# EAGLE design PCB_Univ_V0 (EAGLE 9.6.1)
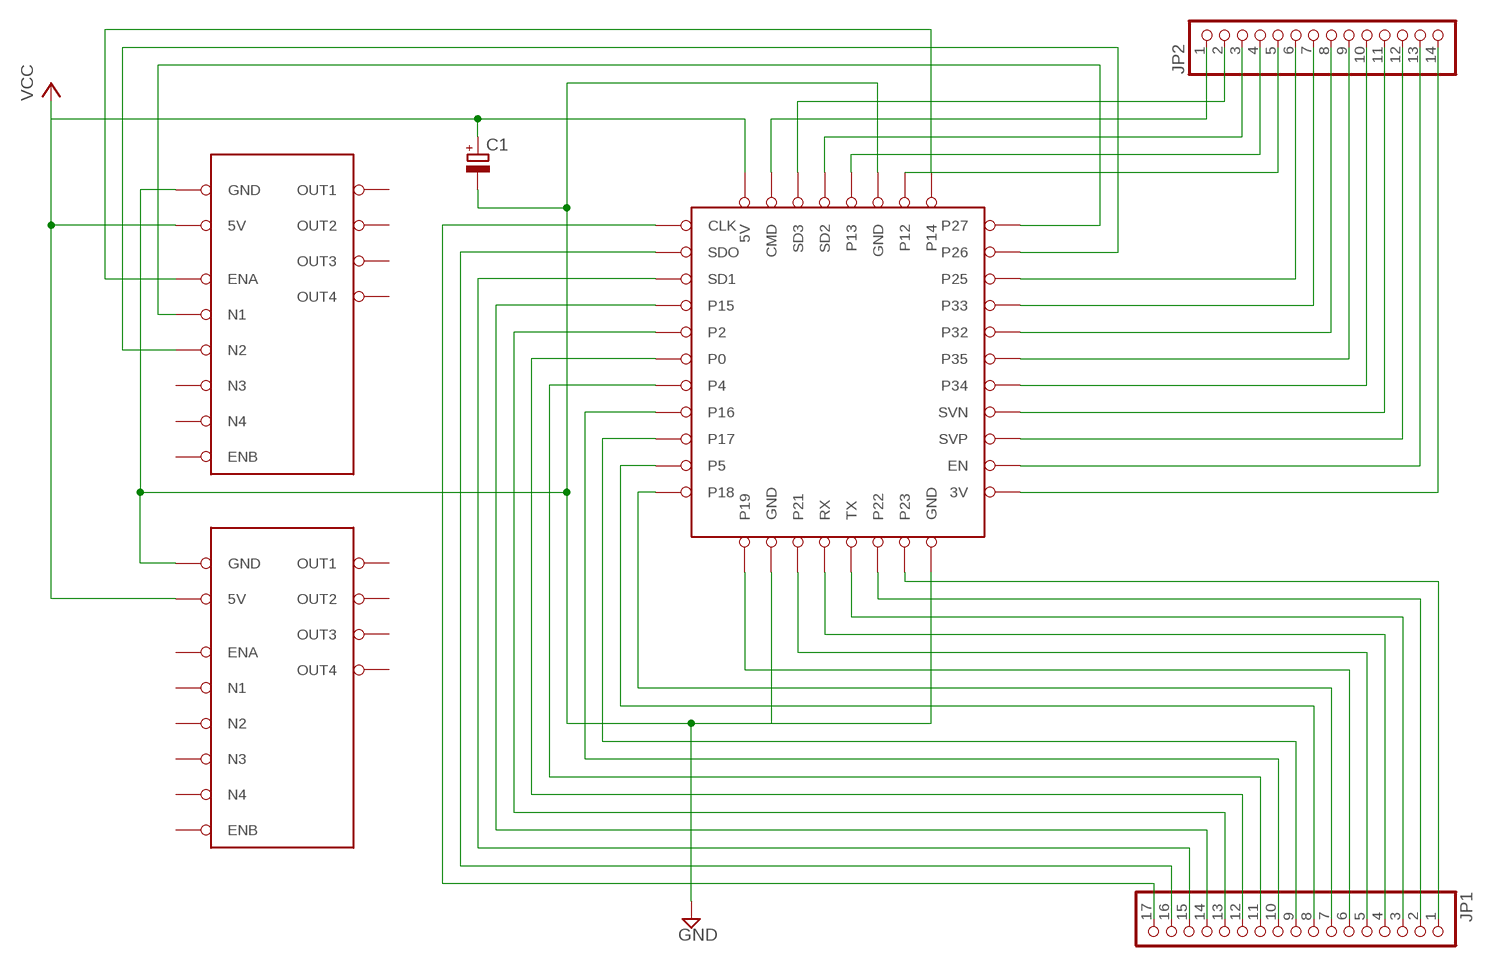
[diagram p0: schematic, sheet 1]

## Parts
C1  CPOL-EUE3.5-8  [E3,5-8]
ESP1  ESP12_MOD  [ESP32_MOD]
JP1  PINHD-1X17  [1X17]
JP2  PINHD-1X14  [1X14]
U$1  DRIVER_MOTOR  [DRIVER_MOTOR]
U$2  DRIVER_MOTOR  [DRIVER_MOTOR]

## Nets
GND: C1.- ESP1.P$13(GND) ESP1.P$19(GND) ESP1.P$33(GND) U$1.GND U$2.GND
N$1: ESP1.P$30(P27) U$1.N1
N$2: ESP1.P$29(P26) U$1.N2
N$3: ESP1.P$31(P14) U$1.ENA
N$4: ESP1.P$37(CMD) JP2.1
N$5: ESP1.P$36(SD3) JP2.2
N$6: ESP1.P$35(SD2) JP2.3
N$7: ESP1.P$34(P13) JP2.4
N$8: ESP1.P$32(P12) JP2.5
N$9: ESP1.P$28(P25) JP2.6
N$10: ESP1.P$27(P33) JP2.7
N$11: ESP1.P$26(P32) JP2.8
N$12: ESP1.P$25(P35) JP2.9
N$13: ESP1.P$24(P34) JP2.10
N$14: ESP1.P$23(SVN) JP2.11
N$15: ESP1.P$22(SVP) JP2.12
N$16: ESP1.P$21(EN) JP2.13
N$17: ESP1.P$20(3V) JP2.14
N$18: ESP1.P$18(P23) JP1.1
N$19: ESP1.P$17(P22) JP1.2
N$20: ESP1.P$16(TX) JP1.3
N$21: ESP1.P$15(RX) JP1.4
N$22: ESP1.P$14(P21) JP1.5
N$23: ESP1.P$12(P19) JP1.6
N$24: ESP1.P$11(P18) JP1.7
N$25: ESP1.P$10(P5) JP1.8
N$26: ESP1.P$9(P17) JP1.9
N$27: ESP1.P$8(P16) JP1.10
N$28: ESP1.P$7(P4) JP1.11
N$29: ESP1.P$6(P0) JP1.12
N$30: ESP1.P$5(P2) JP1.13
N$31: ESP1.P$4(P15) JP1.14
N$32: ESP1.P$3(SD1) JP1.15
N$33: ESP1.P$2(SDO) JP1.16
N$34: ESP1.P$1(CLK) JP1.17
VCC: C1.+ ESP1.P$38(5V) U$1.5V U$2.5V
Unconnected: U$1.ENB U$1.N3 U$1.N4 U$1.OUT1 U$1.OUT2 U$1.OUT3 U$1.OUT4 U$2.ENA U$2.ENB U$2.N1 U$2.N2 U$2.N3 U$2.N4 U$2.OUT1 U$2.OUT2 U$2.OUT3 U$2.OUT4

## Library data of the parts
C1 = rcl2:CPOL-EU: POLARIZED CAPACITOR, European symbol; SPICEPREFIX: C
ESP1 = DAIMOB:ESP12_MOD
JP1 = pinhead:PINHD-1X17: PIN HEADER
JP2 = pinhead:PINHD-1X14: PIN HEADER
U$1 U$2 = DAIMOB:DRIVER_MOTOR

## Board
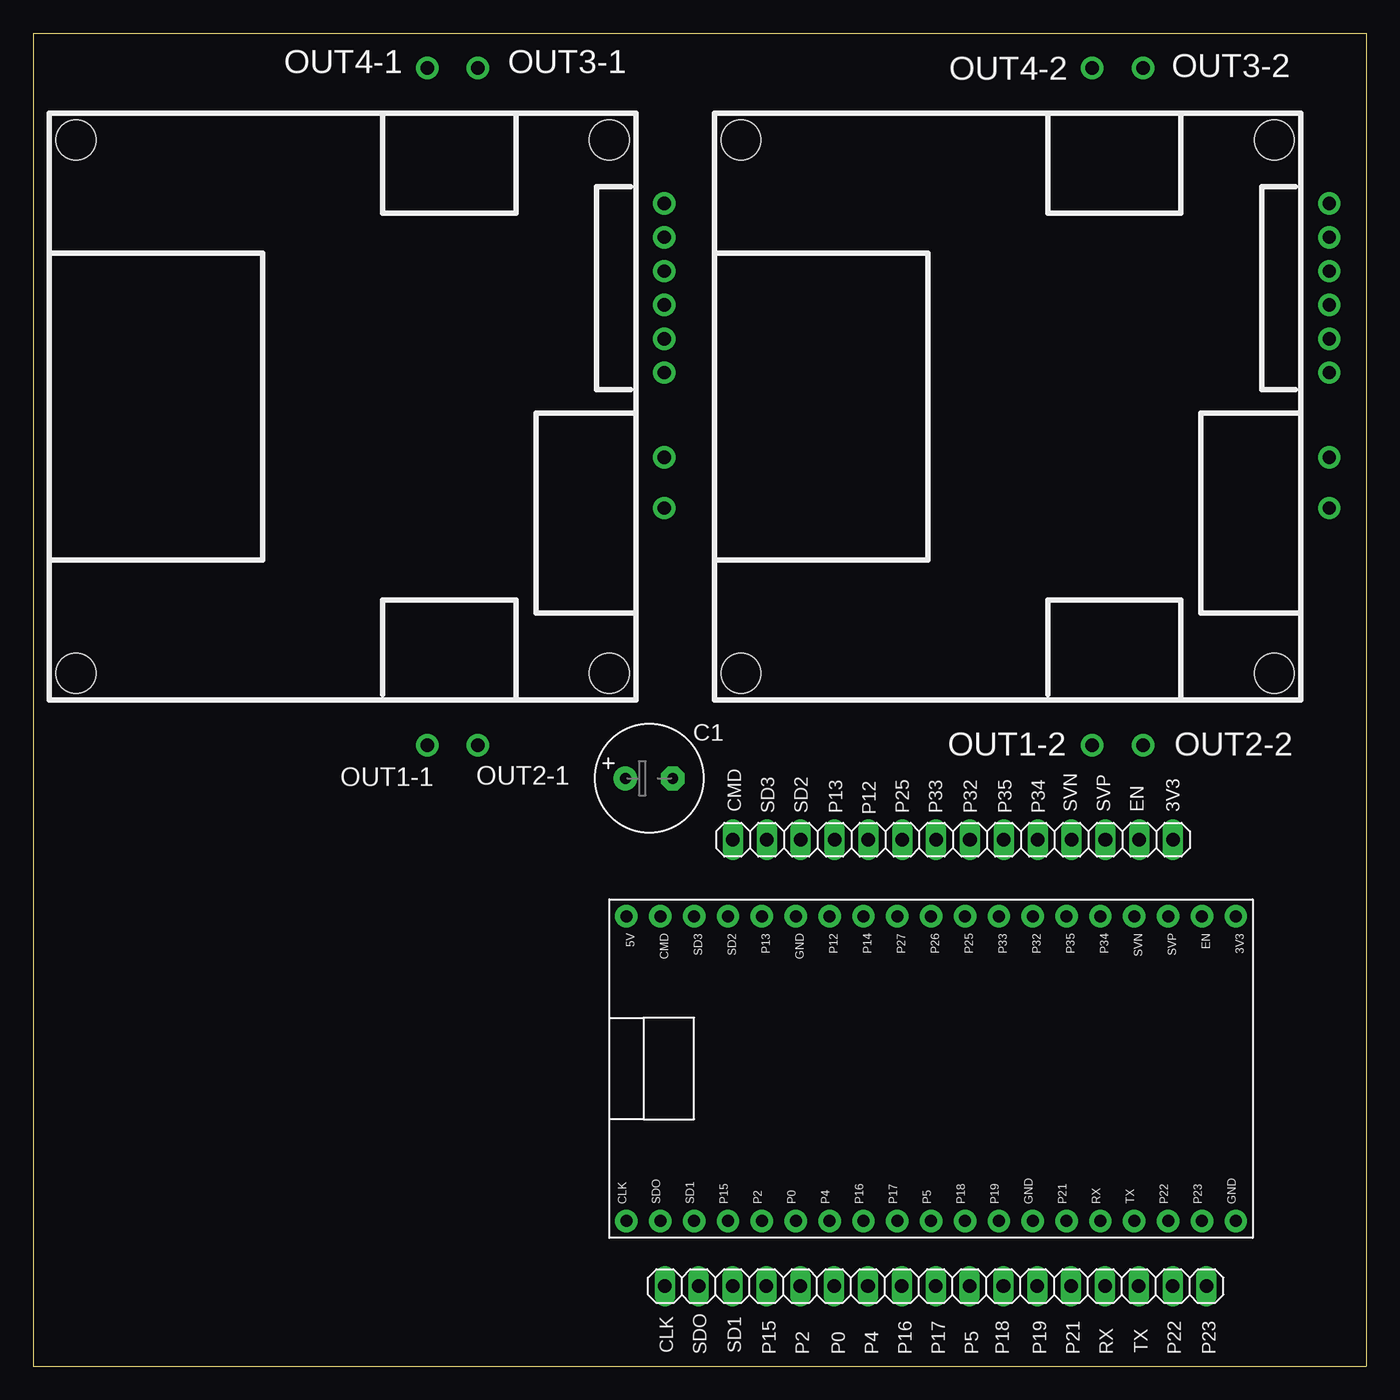
[diagram p1: board, top side]
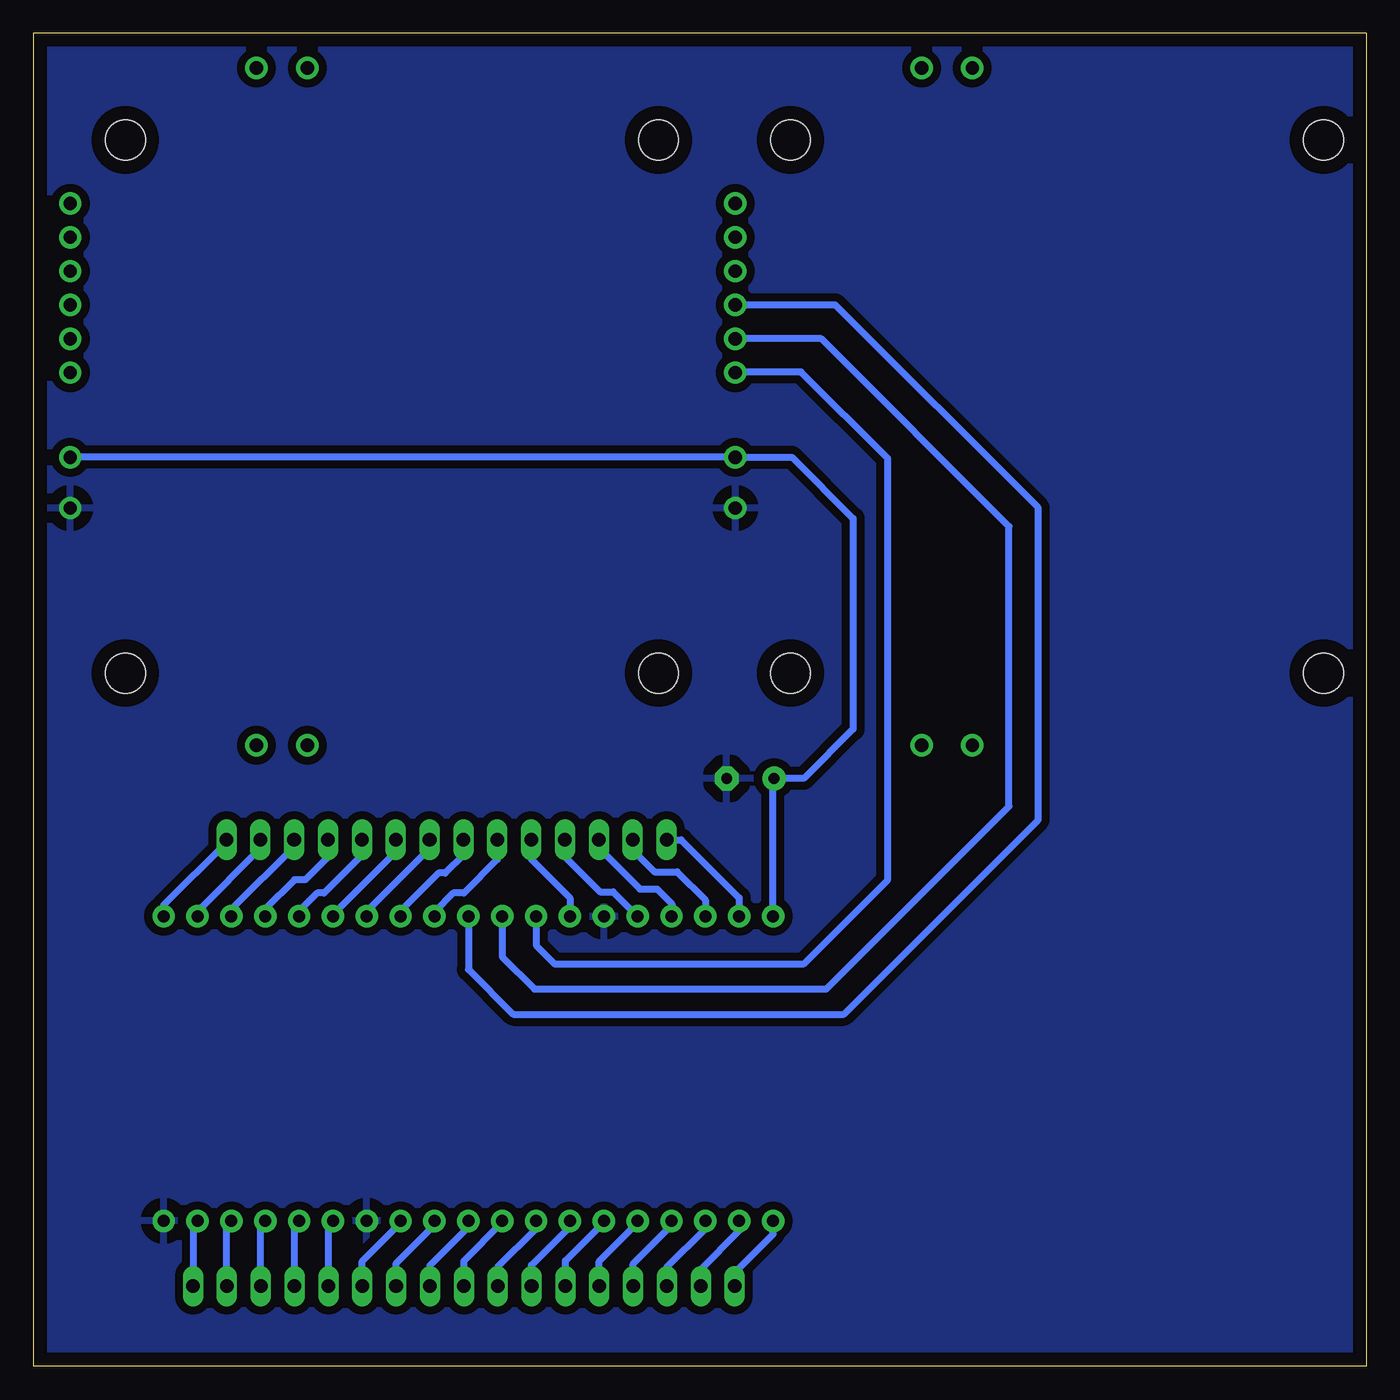
[diagram p2: board, bottom side, seen from below]

Size 100 x 100 mm. Coordinates in mm from the lower left corner, seen from the top.
Outline: 0,100 0,0 100,0 100,100 0,100
Copper layers (1*16): Top 0.035mm / dielectric 1.5mm / Bottom 0.035mm
Design rules "default *": minimum track width 10mil, minimum drill 24mil, track to track 8mil, track to pad 8mil, pad to pad 8mil, via to via 8mil, smd to smd 8mil, copper to edge 40mil, drill to drill 8mil, minimum pad ring 10mil, minimum via ring 8mil, stop-mask expansion 4mil, vias tented up to drill 0mil, thermal gap 35mil

### Footprints (pad centres in the part's own frame; a part is rotated, then mirrored left to right if it is on the bottom)
E3,5-8 = drill 0.813 pad 1.778: + -1.778,0 | drill 0.813 pad 1.778 octagon: - 1.778,0
ESP32_MOD = drill 0.9 pad 1.676: P$1 0,0; P$2 2.54,0; P$3 5.08,0; P$4 7.62,0; P$5 10.16,0; P$6 12.7,0; P$7 15.24,0; P$8 17.78,0; P$9 20.32,0; P$10 22.86,0; P$11 25.4,0; P$12 27.94,0; P$13 30.48,0; P$14 33.02,0; P$15 35.56,0; P$16 38.1,0; P$17 40.64,0; P$18 43.18,0; P$19 45.72,0; P$20 45.72,22.86; P$21 43.18,22.86; P$22 40.64,22.86; P$23 38.1,22.86; P$24 35.56,22.86; P$25 33.02,22.86; P$26 30.48,22.86; P$27 27.94,22.86; P$28 25.4,22.86; P$29 22.86,22.86; P$30 20.32,22.86; P$31 17.78,22.86; P$32 15.24,22.86; P$33 12.7,22.86; P$34 10.16,22.86; P$35 7.62,22.86; P$36 5.08,22.86; P$37 2.54,22.86; P$38 0,22.86
1X17 = drill 1.016 long: 1 -20.32,0; 2 -17.78,0; 3 -15.24,0; 4 -12.7,0; 5 -10.16,0; 6 -7.62,0; 7 -5.08,0; 8 -2.54,0; 9 0,0; 10 2.54,0; 11 5.08,0; 12 7.62,0; 13 10.16,0; 14 12.7,0; 15 15.24,0; 16 17.78,0; 17 20.32,0
1X14 = drill 1.016 long: 1 -16.51,0; 2 -13.97,0; 3 -11.43,0; 4 -8.89,0; 5 -6.35,0; 6 -3.81,0; 7 -1.27,0; 8 1.27,0; 9 3.81,0; 10 6.35,0; 11 8.89,0; 12 11.43,0; 13 13.97,0; 14 16.51,0
DRIVER_MOTOR = drill 1 pad 1.676: 5V -3.81,-24.13; ENA 2.54,-24.13; ENB 15.24,-24.13; GND -7.62,-24.13; N1 5.08,-24.13; N2 7.62,-24.13; N3 10.16,-24.13; N4 12.7,-24.13; OUT1 -25.4,-6.35; OUT2 -25.4,-10.16; OUT3 25.4,-10.16; OUT4 25.4,-6.35 | hole 3: -20,20; 20,20; 20,-20; -20,-20

### Placement (x,y rotation side)
C1  46.2,44.1 0 top
ESP1  44.5,10.9 0 top
JP1  67.7,6 180 top
JP2  69,39.5 0 top
U$1  23.2,72 90 top
U$2  73.1,72 90 top

### Tracks (layer width: path | path; a pad name or v marks a point on that pad's centre or on a via)
GND
  pour Bottom (isolate 0.61): 0.1,99.8 99.7,99.8 99.7,0.3 0.1,0.3
N$1
  Bottom 0.508: ESP1.P$30 64.82,30.72 62.4,28.3 40.5,28.3 26.8,42 26.8,63 40.88,77.08 U$1.N1
N$2
  Bottom 0.508: ESP1.P$29 67.36,29.76 64,26.4 39.2,26.4 24.6,41 24.6,64.4 39.82,79.62 U$1.N2
N$3
  Bottom 0.508: ESP1.P$31 62.28,31.58 60.9,30.2 42.2,30.2 35.9,36.5 35.9,68.1 42.4,74.6 47.27,74.6 U$1.ENA
N$4
  Bottom 0.508: JP2.1 51.4,39.5 47.04,35.14 ESP1.P$37
N$5
  Bottom 0.508: JP2.2 54.6,39.07 54.6,38.3 53.4,37.1 51.7,37.1 49.58,34.98 ESP1.P$36
N$6
  Bottom 0.508: JP2.3 57.57,38.87 54.5,35.8 53.2,35.8 52.1,34.7 52.1,33.78 ESP1.P$35
N$7
  Bottom 0.508: JP2.4 60.11,38.21 57.5,35.6 56.5,35.6 ESP1.P$34
N$8
  Bottom 0.508: JP2.5 62.65,38.05 59.74,35.14 ESP1.P$32
N$9
  Bottom 0.508: JP2.6 65.19,38.01 67.7,35.5 68.5,35.5 69.9,34.1 ESP1.P$28
N$10
  Bottom 0.508: JP2.7 67.73,38.37 69.1,37 69.6,37 72.44,34.16 ESP1.P$27
N$11
  Bottom 0.508: JP2.8 70.27,38.83 74.98,34.12 ESP1.P$26
N$12
  Bottom 0.508: JP2.9 72.81,38.59 77.52,33.88 ESP1.P$25
N$13
  Bottom 0.508: JP2.10 75.35,38.35 78.2,35.5 78.7,35.5 80.06,34.14 ESP1.P$24
N$14
  Bottom 0.508: JP2.11 77.89,38.21 79.6,36.5 80.4,36.5 82.6,34.3 ESP1.P$23
N$15
  Bottom 0.508: JP2.12 80.43,38.97 85.14,34.26 ESP1.P$22
N$16
  Bottom 0.508: JP2.13 82.97,38.83 87.7,34.1 87.7,33.78 ESP1.P$21
N$17
  Bottom 0.508: JP2.14 85.51,39.3 90.22,34.59 ESP1.P$20
N$18
  Bottom 0.508: ESP1.P$18 88.02,10.56 JP1.1
N$19
  Bottom 0.508: JP1.2 85.48,10.56 ESP1.P$17
N$20
  Bottom 0.508: JP1.3 82.94,10.56 ESP1.P$16
N$21
  Bottom 0.508: JP1.4 80.4,10.56 ESP1.P$15
N$22
  Bottom 0.508: JP1.5 77.86,10.56 ESP1.P$14
N$23
  Bottom 0.508: 75.32,5.98 JP1.6 75.32,7.88 72.44,10.76 ESP1.P$12
N$24
  Bottom 0.508: 72.78,6.12 JP1.7 72.78,7.72 69.9,10.6 ESP1.P$11
N$25
  Bottom 0.508: 70.24,6.46 JP1.8 70.24,7.56 67.36,10.44 ESP1.P$10
N$26
  Bottom 0.508: 67.7,6.5 JP1.9 67.7,7.9 64.82,10.78 ESP1.P$9
N$27
  Bottom 0.508: 65.16,6.14 JP1.10 65.16,7.44 62.28,10.32 ESP1.P$8
N$28
  Bottom 0.508: 62.62,6.28 JP1.11 62.62,7.58 59.74,10.46 ESP1.P$7
N$29
  Bottom 0.508: 60.08,6.52 JP1.12 60.08,7.92 57.2,10.8 ESP1.P$6
N$30
  Bottom 0.508: 57.54,6.16 JP1.13 57.54,7.86 54.66,10.74 ESP1.P$5
N$31
  Bottom 0.508: 55,6.1 JP1.14 55,7.7 52.12,10.58 ESP1.P$4
N$32
  Bottom 0.508: 52.46,6.14 JP1.15 52.46,7.44 49.58,10.32 ESP1.P$3
N$33
  Bottom 0.508: 49.92,6.28 JP1.16 49.92,7.28 47.04,10.16 ESP1.P$2
N$34
  Bottom 0.508: JP1.17 47.38,7.02 44.5,9.9 ESP1.P$1
VCC
  Bottom 0.508: ESP1.P$38 44.5,44.02 C1.+ 42.2,44.1 38.5,47.8 38.5,63.6 43.09,68.19 U$1.5V U$2.5V

### Text on the board
tNames: OUT4-1 | OUT3-1 | OUT3-2 | OUT4-2 | OUT1-2 | OUT2-2 | OUT1-1 | OUT2-1 | CMD | SD3 | SD2 | P13 | P25 | P33 | P32 | P35 | P34 | SVN | SVP | EN | 3V3 | P12 | CLK | SDO | SD1 | P15 | P2 | P0 | P4 | P16 | P17 | P5 | P18 | P19 | P21 | RX | TX | P22 | P23